# EAGLE design DAPbench-LPC11U35-v1.0.0 (EAGLE 7.7.0)

## Sheet 1 of 4
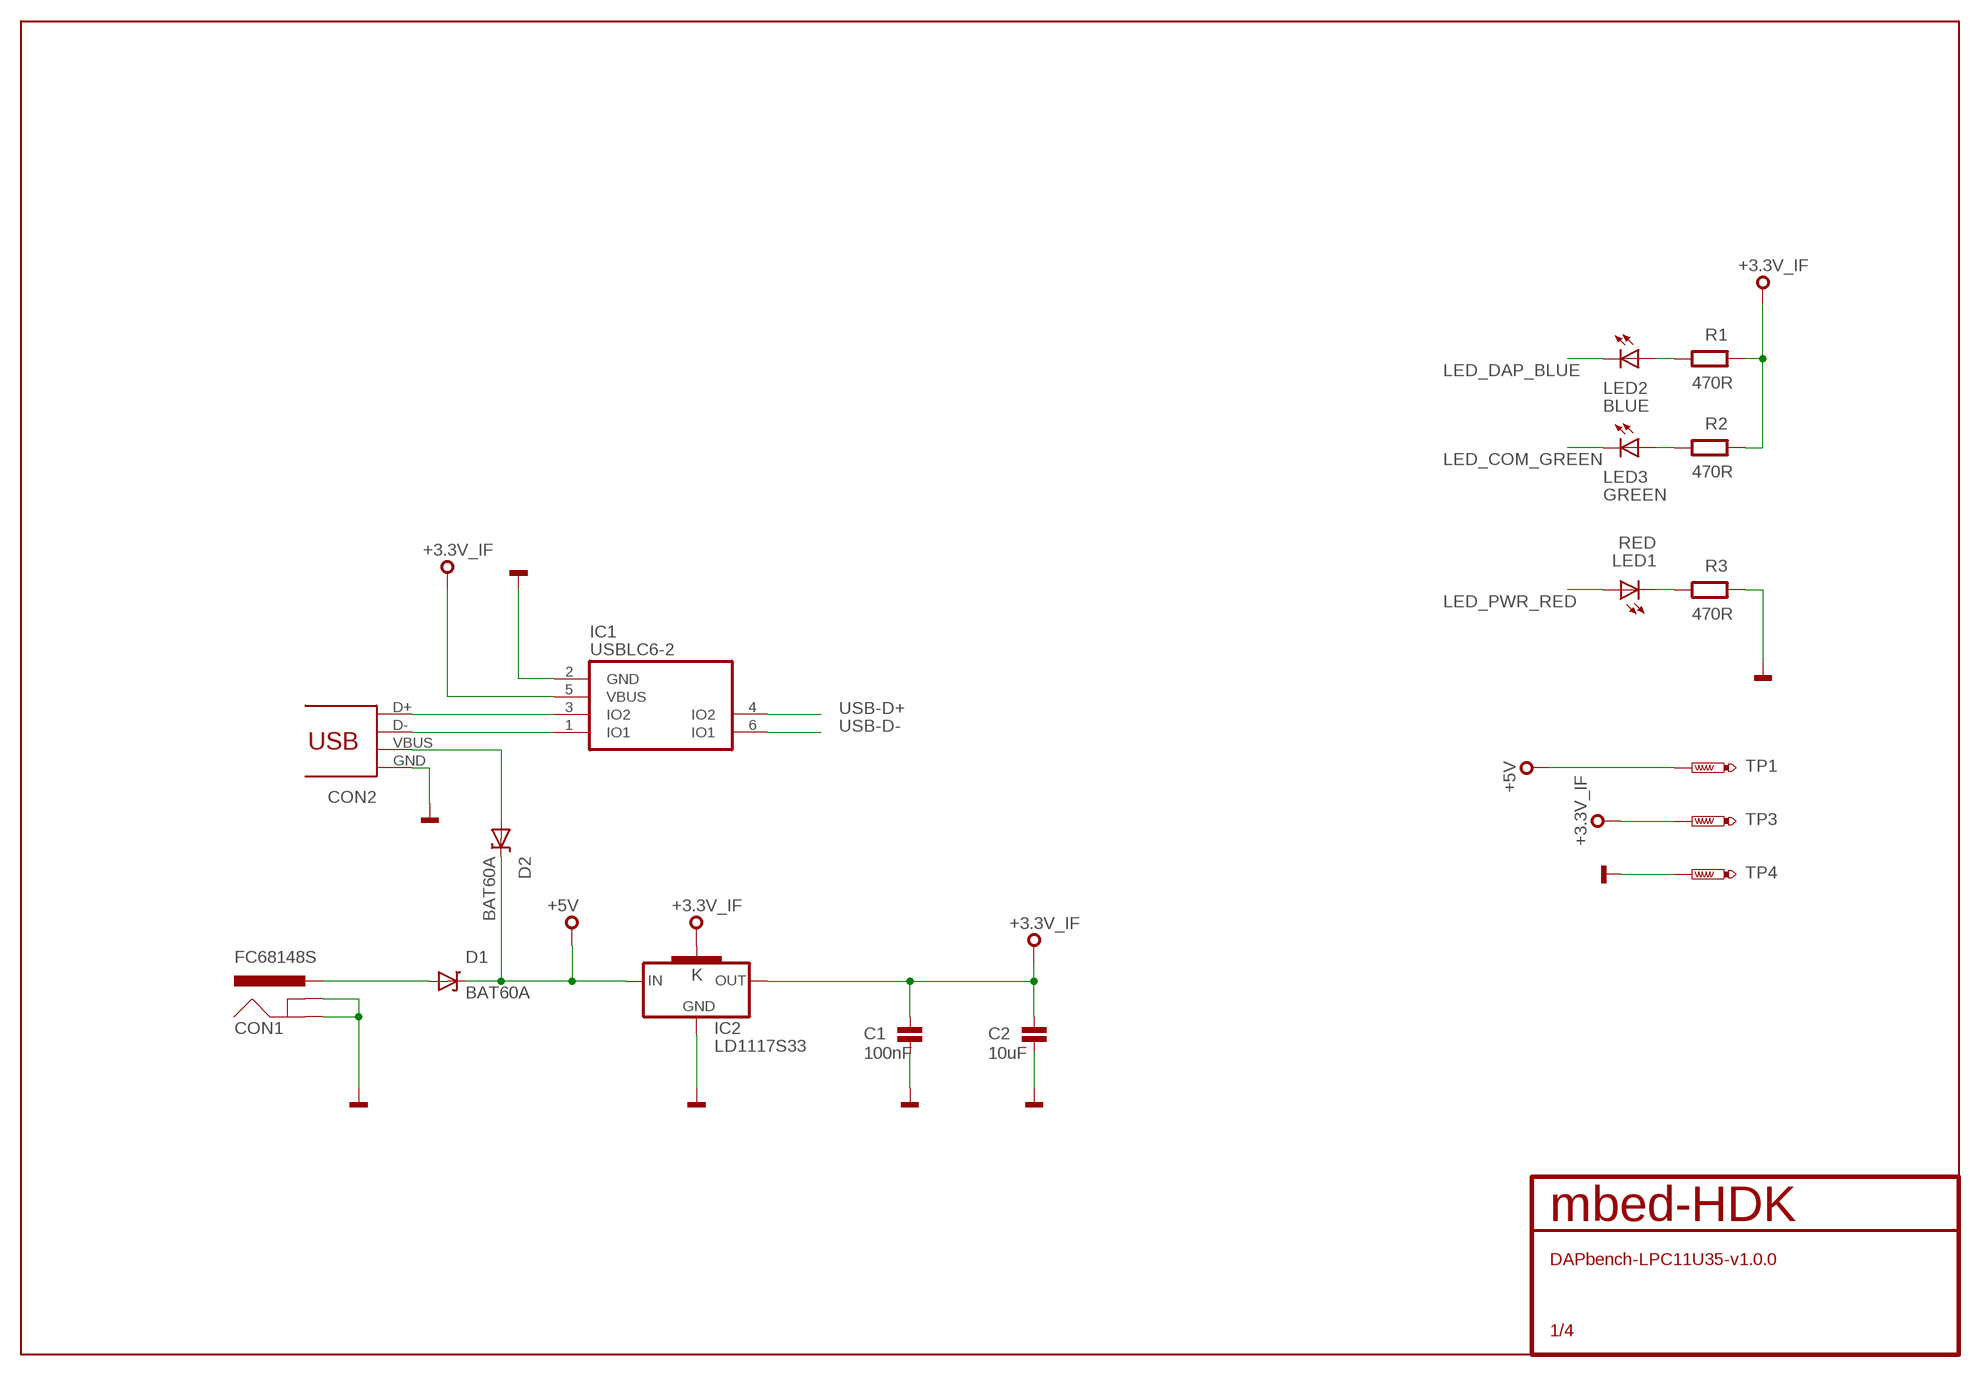
[diagram p0: schematic, sheet 1]

### Parts
C1  100nF  C0603  [0603]
C2  10uF  C0603  [0603]
CON1  FC68148S  [FC68148S]
CON2  USB_MICROB  [MOLEX-47364-0001]
D1  BAT60A  [SOD323]
D2  BAT60A  [SOD323]
IC1  USBLC6-2SC6  [SOT23-6L]
IC2  LD1117S33  [SOT223]
LED1  RED  LED0603  [CHIPLED_0603]
LED2  BLUE  LED0603  [CHIPLED_0603]
LED3  GREEN  LED0603  [CHIPLED_0603]
R1  470R  R0603  [0603@1]
R2  470R  R0603  [0603@1]
R3  470R  R0603  [0603@1]
TP1  TEST-POINT-50R-PTH  [TP50-PTH]
TP3  TEST-POINT-50R-PTH  [TP50-PTH]
TP4  TEST-POINT-50R-PTH  [TP50-PTH]

### Nets
+3.3V_IF: C1.1 C2.1 IC1.5(VBUS) IC2.2(OUT) IC2.4(K) R1.1 R2.1 TP3.TP ; also sheet 2,3,4
+5V: D1.K D2.K IC2.3(IN) TP1.TP ; also sheet 3,4
GND: C1.2 C2.2 CON1.2(GNDBREAK) CON1.3(GND) CON2.GND IC1.2(GND) IC2.1(GND) R3.1 TP4.TP ; also sheet 2,3,4
LED_COM_GREEN: LED3.C ; also sheet 2
LED_DAP_BLUE: LED2.C ; also sheet 2
LED_PWR_RED: LED1.A ; also sheet 2
N$2: LED3.A R2.2
N$3: CON2.D- IC1.1(IO1)
N$4: CON2.D+ IC1.3(IO2)
N$7: LED2.A R1.2
N$8: CON2.VBUS D2.A
N$9: CON1.1-1(PWR) CON1.1-2(PWR) D1.A
N$16: LED1.C R3.2
USB-D+: IC1.4(IO2) ; also sheet 2
USB-D-: IC1.6(IO1) ; also sheet 2

## Sheet 2 of 4
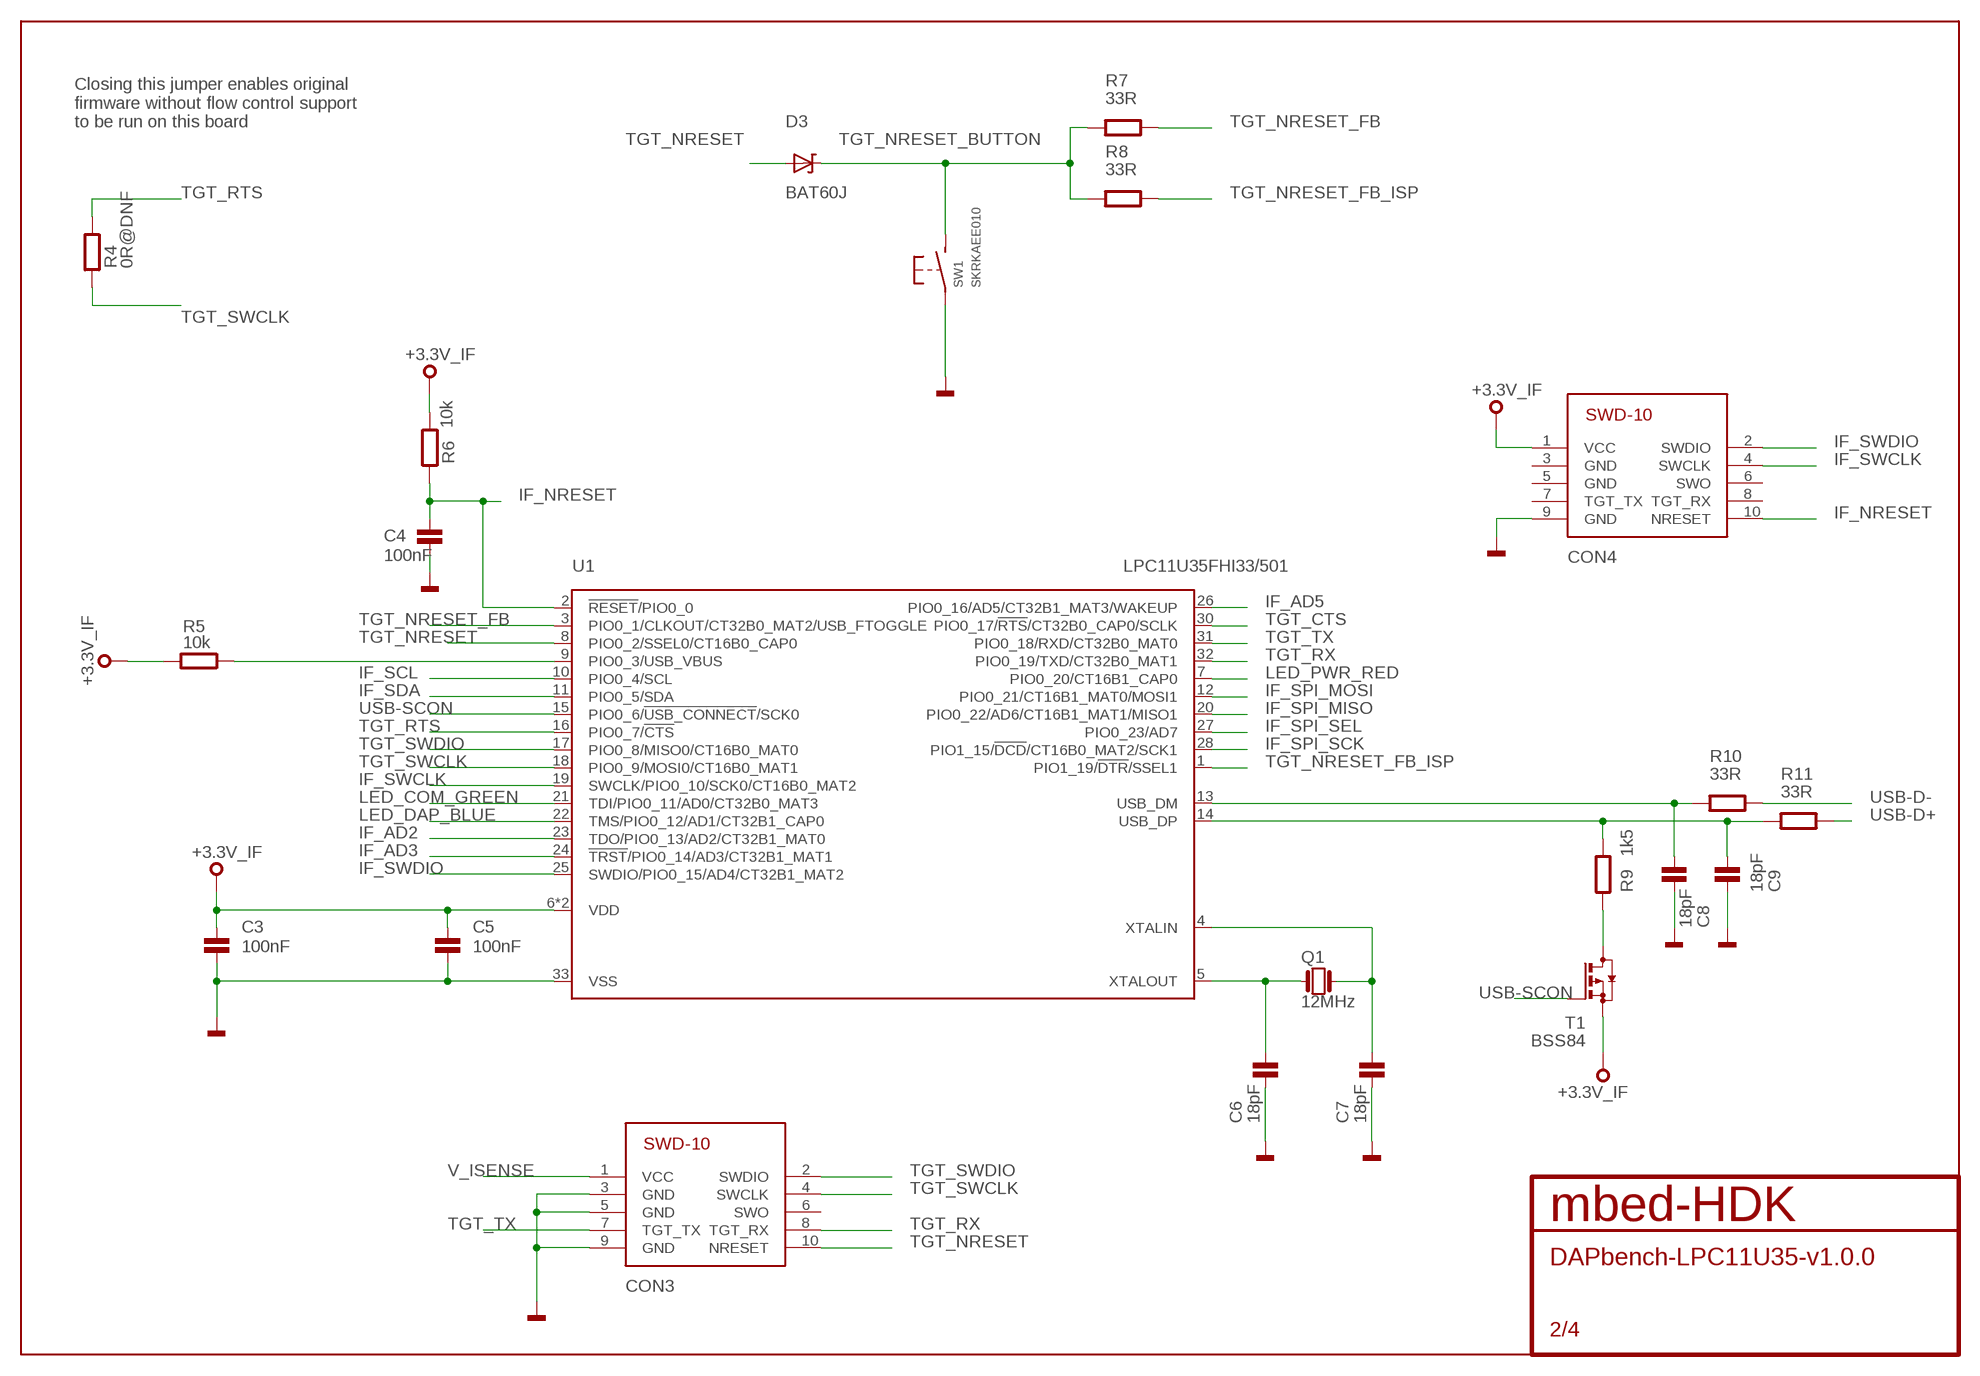
[diagram p1: schematic, sheet 2]

### Parts
C3  100nF  C0603  [0603]
C4  100nF  C0603  [0603]
C5  100nF  C0603  [0603]
C6  18pF  C0603  [0603]
C7  18pF  C0603  [0603]
C8  18pF  C0603  [0603]
C9  18pF  C0603  [0603]
CON3  SWD-10/TC2050_SMD  [FTSH-105-02]
CON4  SWD-10/TC2050_SMD  [FTSH-105-02]
D3  BAT60J  BAT60A  [BAT60A]
Q1  12MHz  Q_3.2X2.5  [3.2X.2.5]
R4  0R@DNF  R0402  [0402@1]
R5  10k  R0603  [0603@1]
R6  10k  R0603  [0603@1]
R7  33R  R0603  [0603@1]
R8  33R  R0603  [0603@1]
R9  1k5  R0603  [0603@1]
R10  33R  R0603  [0603@1]
R11  33R  R0603  [0603@1]
SW1  SKRKAEE010  [SKRKAEE010]
T1  BSS84  [SOT23]
U1  LPC11U35FHI33/501  [SOT617-3]

### Nets
+3.3V_IF: C3.1 C5.1 CON4.1(VCC) R5.2 R6.2 T1.2(S) U1.6(VDD) U1.29(VDD) ; also sheet 1,3,4
GND: C3.2 C4.2 C5.2 C6.2 C7.2 C8.2 C9.2 CON3.3(GND) CON3.5(GND) CON3.9(GND) CON4.9(GND) SW1.P$1(P) U1.33(VSS) ; also sheet 1,3,4
IF_AD2: U1.23(TDO/PIO0_13/AD2/CT32B1_MAT0) ; also sheet 3
IF_AD3: U1.24(!TRST!/PIO0_14/AD3/CT32B1_MAT1) ; also sheet 3
IF_AD5: U1.26(PIO0_16/AD5/CT32B1_MAT3/WAKEUP) ; also sheet 3
IF_NRESET: C4.1 CON4.10(NRESET) R6.1 U1.2(!RESET!/PIO0_0)
IF_SCL: U1.10(PIO0_4/SCL) ; also sheet 3,4
IF_SDA: U1.11(PIO0_5/SDA) ; also sheet 3,4
IF_SPI_MISO: U1.20(PIO0_22/AD6/CT16B1_MAT1/MISO1) ; also sheet 3
IF_SPI_MOSI: U1.12(PIO0_21/CT16B1_MAT0/MOSI1) ; also sheet 3
IF_SPI_SCK: U1.28(PIO1_15/!DCD!/CT16B0_MAT2/SCK1) ; also sheet 3
IF_SPI_SEL: U1.27(PIO0_23/AD7) ; also sheet 3
IF_SWCLK: CON4.4(SWCLK) U1.19(SWCLK/PIO0_10/SCK0/CT16B0_MAT2)
IF_SWDIO: CON4.2(SWDIO) U1.25(SWDIO/PIO0_15/AD4/CT32B1_MAT2)
LED_COM_GREEN: U1.21(TDI/PIO0_11/AD0/CT32B0_MAT3) ; also sheet 1
LED_DAP_BLUE: U1.22(TMS/PIO0_12/AD1/CT32B1_CAP0) ; also sheet 1
LED_PWR_RED: U1.7(PIO0_20/CT16B1_CAP0) ; also sheet 1
N$18: C6.1 Q1.P$1 U1.5(XTALOUT)
N$19: C7.1 Q1.P$3 U1.4(XTALIN)
N$20: R5.1 U1.9(PIO0_3/USB_VBUS)
N$23: R9.1 T1.3(D)
TGT_CTS: U1.30(PIO0_17/!RTS!/CT32B0_CAP0/SCLK) ; also sheet 3
TGT_NRESET: CON3.10(NRESET) D3.A U1.8(PIO0_2/SSEL0/CT16B0_CAP0) ; also sheet 3
TGT_NRESET_BUTTON: D3.K R7.2 R8.2 SW1.P$2(S)
TGT_NRESET_FB: R7.1 U1.3(PIO0_1/CLKOUT/CT32B0_MAT2/USB_FTOGGLE)
TGT_NRESET_FB_ISP: R8.1 U1.1(PIO1_19/!DTR!/SSEL1)
TGT_RTS: R4.2 U1.16(PIO0_7/!CTS!) ; also sheet 3
TGT_RX: CON3.8(TGT_RX) U1.32(PIO0_19/TXD/CT32B0_MAT1) ; also sheet 3
TGT_SWCLK: CON3.4(SWCLK) R4.1 U1.18(PIO0_9/MOSI0/CT16B0_MAT1) ; also sheet 3
TGT_SWDIO: CON3.2(SWDIO) U1.17(PIO0_8/MISO0/CT16B0_MAT0) ; also sheet 3
TGT_TX: CON3.7(TGT_TX) U1.31(PIO0_18/RXD/CT32B0_MAT0) ; also sheet 3
USB-D+: R11.1 ; also sheet 1
USB-D-: R10.1 ; also sheet 1
USB-SCON: T1.1(G) U1.15(PIO0_6/!USB_CONNECT!/SCK0)
USB_DM: C8.1 R10.2 U1.13(USB_DM)
USB_DP: C9.1 R9.2 R11.2 U1.14(USB_DP)
V_ISENSE: CON3.1(VCC) ; also sheet 3
Unconnected: CON3.6(SWO) CON4.3(GND) CON4.5(GND) CON4.6(SWO) CON4.7(TGT_TX) CON4.8(TGT_RX)

### Notes on the sheet
- Closing this jumper enables original
  firmware without flow control support
  to be run on this board

## Sheet 3 of 4
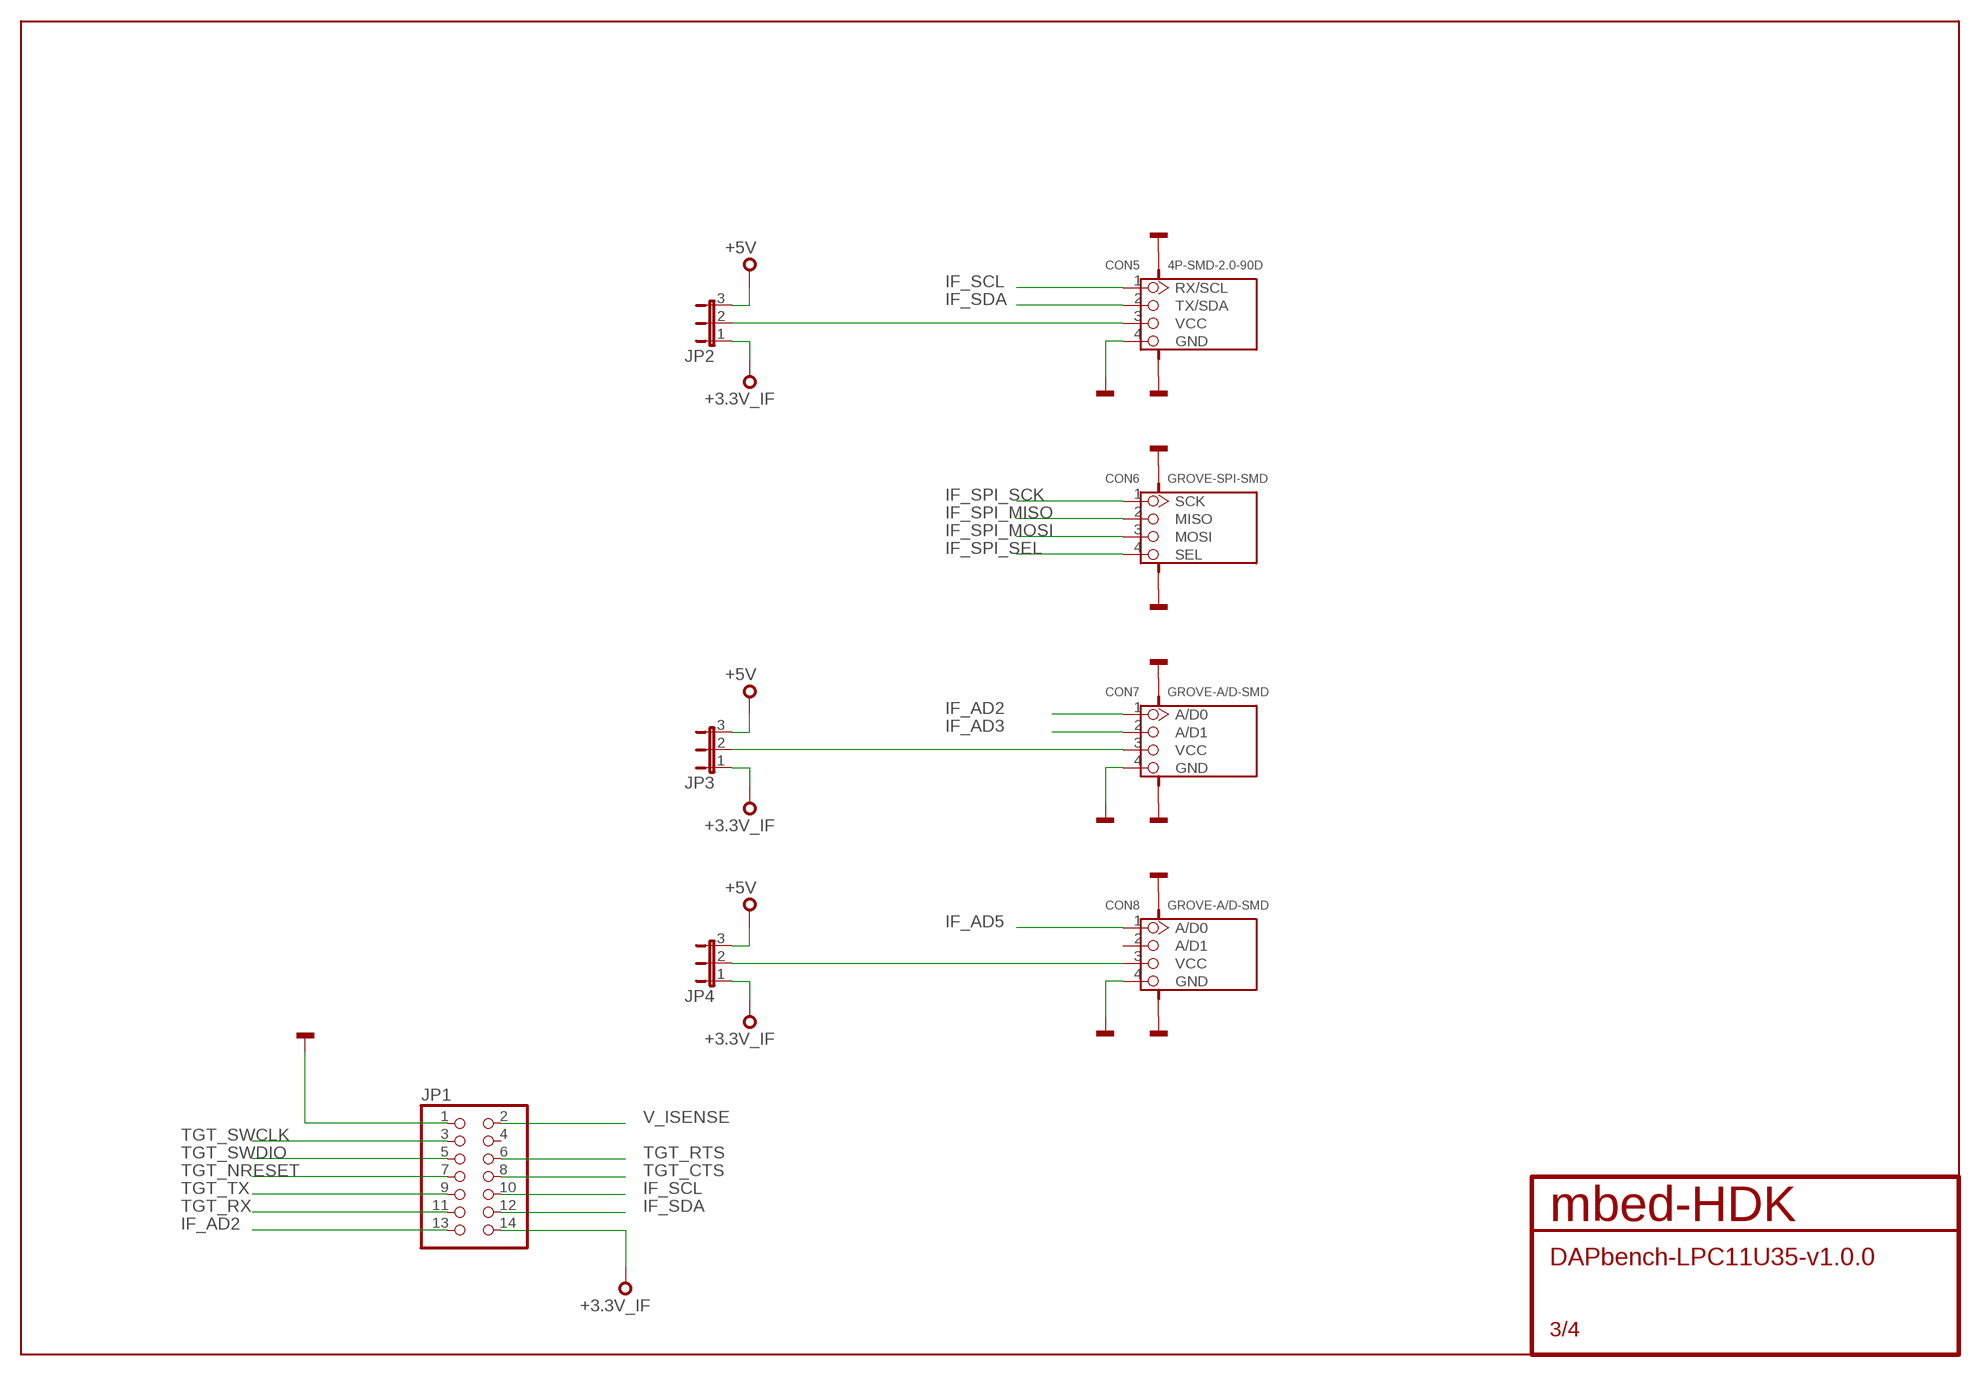
[diagram p2: schematic, sheet 3]

### Parts
CON5  4P-SMD-2.0-90D  GROVE-UART-I2C-SMD  [HW4-SMD-2.0-90D]
CON6  GROVE-SPI-SMD  [HW4-SMD-2.0-90D]
CON7  GROVE-A/D-SMD  [HW4-SMD-2.0-90D]
CON8  GROVE-A/D-SMD  [HW4-SMD-2.0-90D]
JP1  PINHD-2X7  [2X07]
JP2  JP2E  [JP2]
JP3  JP2E  [JP2]
JP4  JP2E  [JP2]

### Nets
+3.3V_IF: JP1.14 JP2.1 JP3.1 JP4.1 ; also sheet 1,2,4
+5V: JP2.3 JP3.3 JP4.3 ; also sheet 1,4
GND: CON5.4(GND) CON5.SS1 CON5.SS2 CON6.SS1 CON6.SS2 CON7.4(GND) CON7.SS1 CON7.SS2 CON8.4(GND) CON8.SS1 CON8.SS2 JP1.1 ; also sheet 1,2,4
IF_AD2: CON7.1(A/D0) JP1.13 ; also sheet 2
IF_AD3: CON7.2(A/D1) ; also sheet 2
IF_AD5: CON8.1(A/D0) ; also sheet 2
IF_SCL: CON5.1(RX/SCL) JP1.10 ; also sheet 2,4
IF_SDA: CON5.2(TX/SDA) JP1.12 ; also sheet 2,4
IF_SPI_MISO: CON6.2(MISO) ; also sheet 2
IF_SPI_MOSI: CON6.3(MOSI) ; also sheet 2
IF_SPI_SCK: CON6.1(SCK) ; also sheet 2
IF_SPI_SEL: CON6.4(SEL) ; also sheet 2
N$1: CON5.3(VCC) JP2.2
N$5: CON7.3(VCC) JP3.2
N$6: CON8.3(VCC) JP4.2
TGT_CTS: JP1.8 ; also sheet 2
TGT_NRESET: JP1.7 ; also sheet 2
TGT_RTS: JP1.6 ; also sheet 2
TGT_RX: JP1.11 ; also sheet 2
TGT_SWCLK: JP1.3 ; also sheet 2
TGT_SWDIO: JP1.5 ; also sheet 2
TGT_TX: JP1.9 ; also sheet 2
V_ISENSE: JP1.2 ; also sheet 2
Unconnected: CON8.2(A/D1) JP1.4

## Sheet 4 of 4
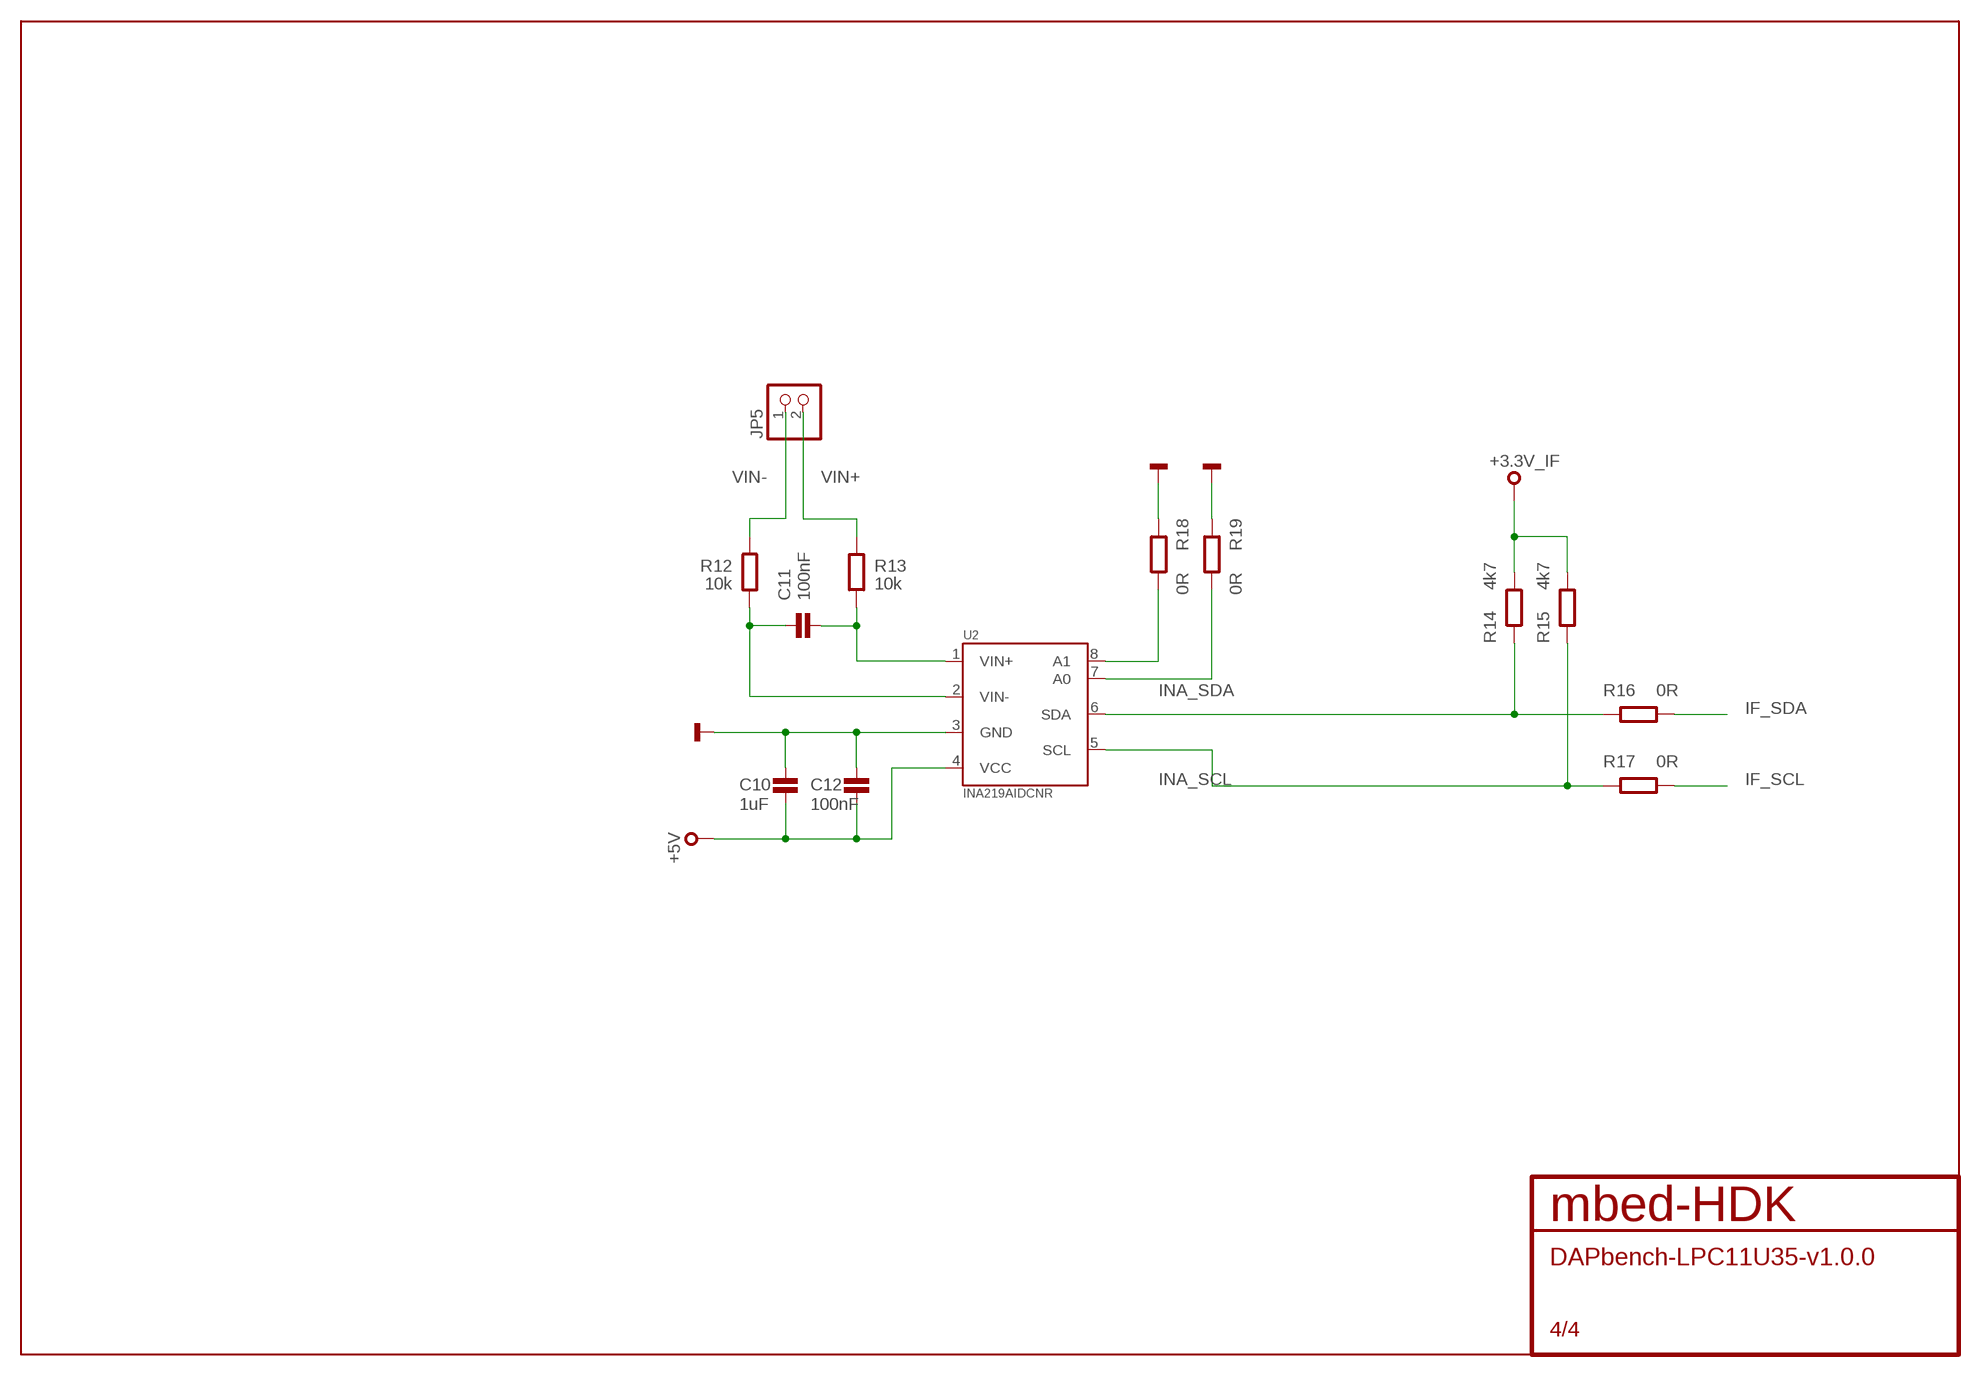
[diagram p3: schematic, sheet 4]

### Parts
C10  1uF  C0603  [0603]
C11  100nF  C0603  [0603]
C12  100nF  C0603  [0603]
JP5  PINHD-1X2  [1X02]
R12  10k  R0603  [0603@1]
R13  10k  R0603  [0603@1]
R14  4k7  R0603  [0603@1]
R15  4k7  R0603  [0603@1]
R16  0R  R0603  [0603@1]
R17  0R  R0603  [0603@1]
R18  0R  R0603  [0603@1]
R19  0R  R0603  [0603@1]
U2  INA219AIDCNR  [SOT23-8]

### Nets
+3.3V_IF: R14.1 R15.1 ; also sheet 1,2,3
+5V: C10.2 C12.2 U2.4(VCC) ; also sheet 1,3
GND: C10.1 C12.1 R18.2 R19.2 U2.3(GND) ; also sheet 1,2,3
IF_SCL: R17.1 ; also sheet 2,3
IF_SDA: R16.1 ; also sheet 2,3
INA_SCL: R15.2 R17.2 U2.5(SCL)
INA_SDA: R14.2 R16.2 U2.6(SDA)
N$13: R18.1 U2.8(A1)
N$14: R19.1 U2.7(A0)
N$15: C11.2 R12.1 U2.2(VIN-)
N$17: C11.1 R13.1 U2.1(VIN+)
VIN+: JP5.2 R13.2
VIN-: JP5.1 R12.2

## Library data of the parts
C1-C12 = mbed-HDK:C: Capacitor
CON1 = mbed-HDK-Connector:FC68148S: Power Jack This is the standard 5.5mm barrel jack for power. The PTH is the most common, proven, reliable, footprint. The Slot footprint only works if the mill layer is transmitted to the PCB fab house so be warned. Mating wall wart : TOL-00298 (and others); MF: Cliff; MFN: FC68148S; OC_NEWARK: 1889309
CON2 = mbed-HDK:USB: USB Connectors
CON3 CON4 = mbed-HDK-Connector:SWD-10/TC2050: 1mm pitch 10-Pin Cortex Programming Header with optional TC2050 footprint solderless interchangeable
CON5 = mbed-HDK-Connector:GROVE-UART-I2C-SMD: 320110032
CON6 = mbed-HDK-Connector:GROVE-SPI-SMD
CON7 CON8 = mbed-HDK-Connector:GROVE-A/D-SMD
D1 D2 = mbed-HDK-Transistor:BAT60A: SCHOTTKY DIODE; MF: Infineon; MFN: BAT60AE6327HTSA1; OC-DIGIKEY: BAT60AE6327HTSA1CT-ND; OC-MOUSER: 726-BAT60AE6327; OC-NEWARK: 85X4127
D3 = mbed-HDK:BAT60A: Schottky Diode
IC1 = mbed-HDK:USBLC6-2
IC2 = mbed-HDK:LD1117S33: VOLTAGE REGULATOR SMD 3,3V
JP1 = pinhead:PINHD-2X7: PIN HEADER
JP2-JP4 = jumper:JP2E: JUMPER
JP5 = pinhead:PINHD-1X2: PIN HEADER
LED1-LED3 = mbed-HDK:LED: SMD LED
Q1 = mbed-HDK:Q
R1-R19 = mbed-HDK:R
SW1 = mbed-HDK-Switch:SKRKAEE010: MOMENTARY SWITCH PUSH VERTICAL (SPST); MF: ALPS; MFN: SKRKAEE010; OC-MOUSER: 688-SKRKAE
T1 = mbed-HDK:BSS84: P-CHANNEL MOS FET
TP1 TP3 TP4 = mbed-HDK:TEST-POINT
U1 = mbed-HDK-MF-NXP:LPC11U35FHI33: 32 Bit Microcontroller, ARM Cortex-M0, 50 MHz, 64 KB, 12 KB, 33 Pins, HVQFN; MF: NXP; MFN: LPC11U35FHI33/501; OC-DIGIKEY: 568-9586-ND; OC-MOUSER: 771-LPC11U35FHI33501; OC-NEWARK: 2115658
U2 = mbed-HDK-IC:INA219AIDCNR: Current Sense - I2C Bi-Directional CURRENT/POWER MONITOR with I2C Interface; MF: Texas Instruments; MFN: INA219AIDCNR; OC-DIGIKEY: 296-23770-1-ND; OC-MOUSER: 595-INA219AIDCNR; OC-NEWARK: 2295989

## Board
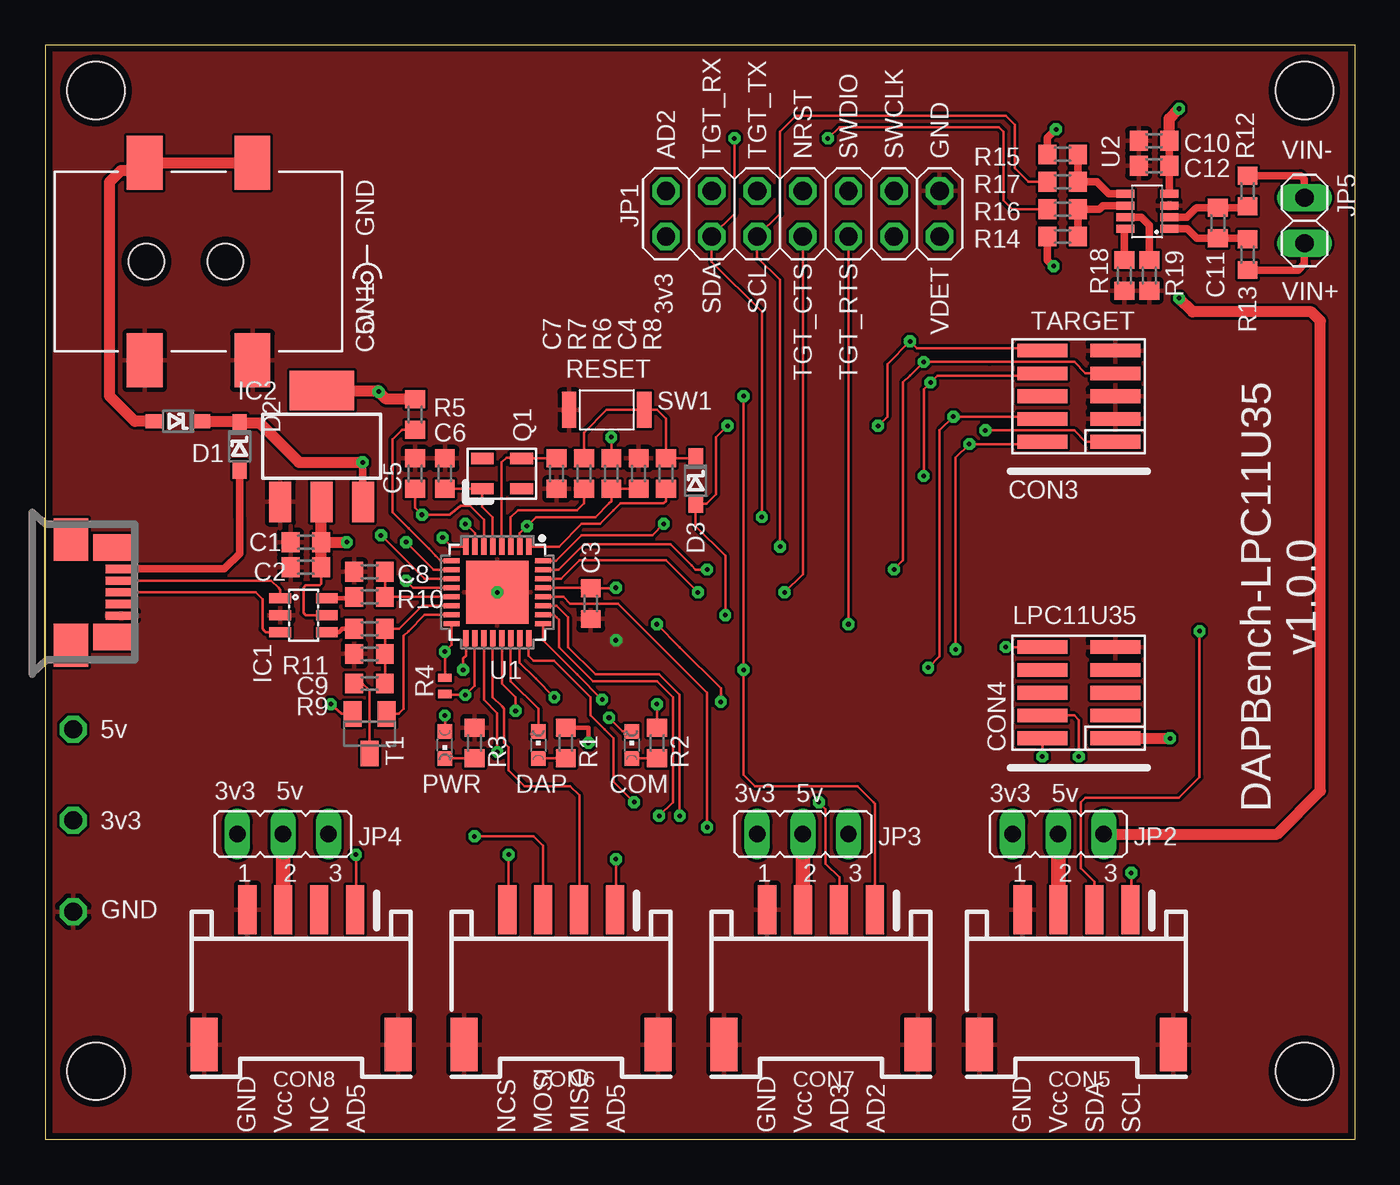
[diagram p4: board, top side]
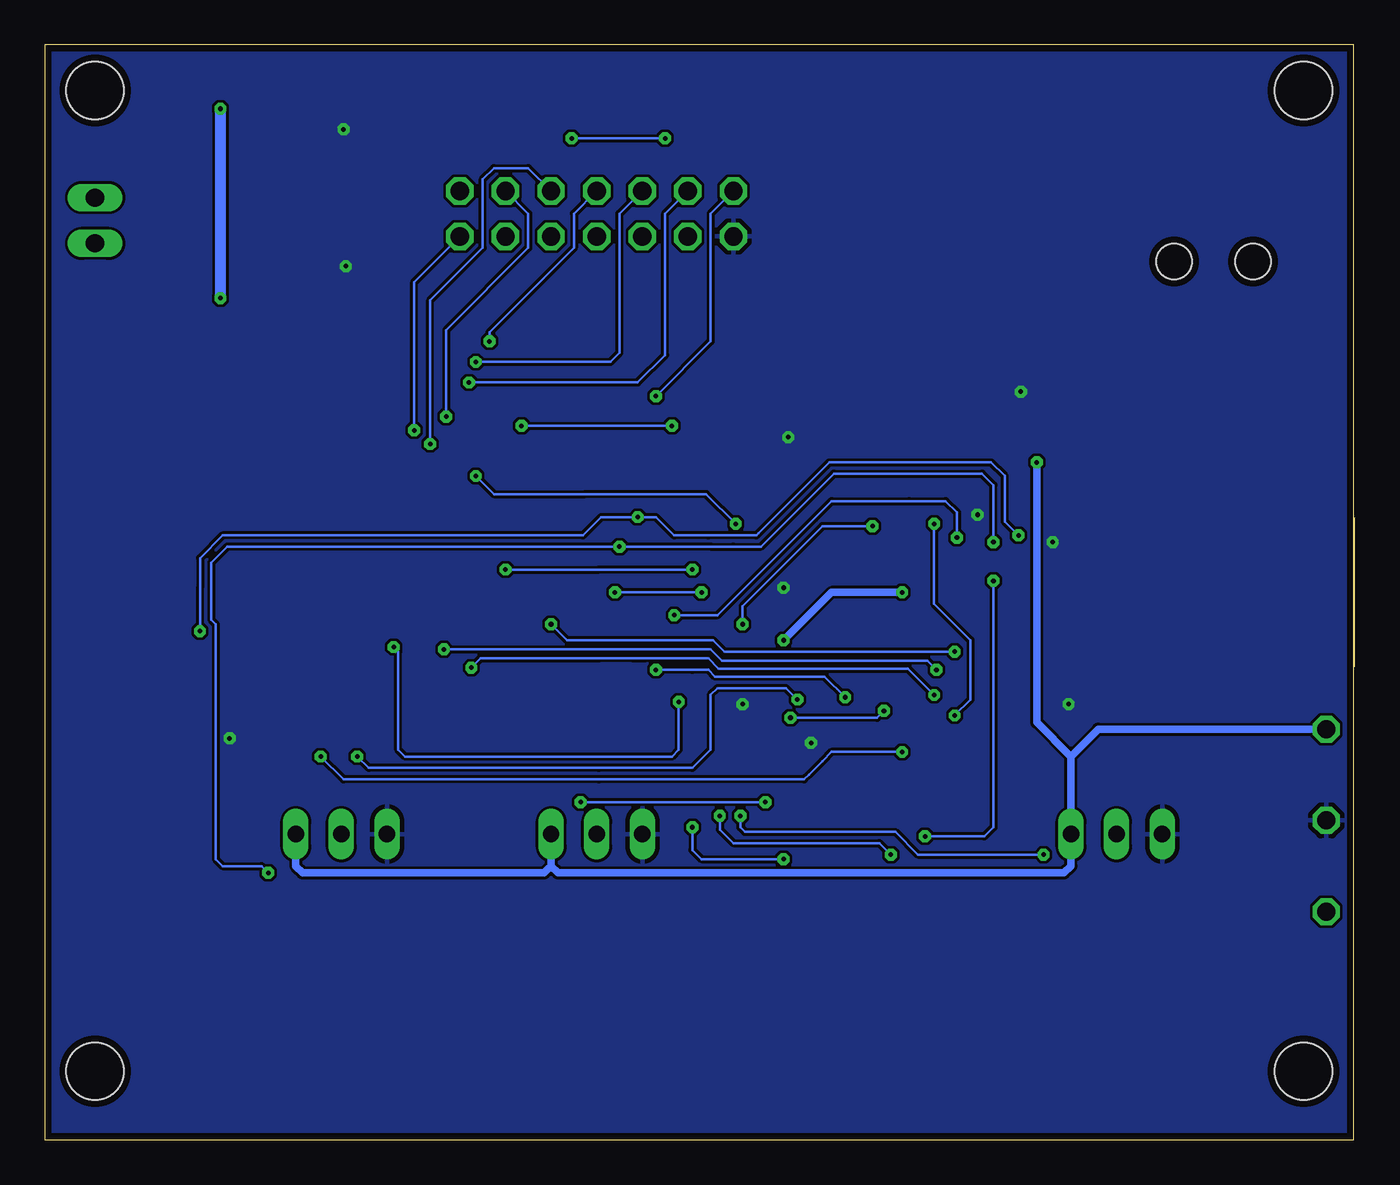
[diagram p5: board, bottom side, seen from below]

Size 72.95 x 60.96 mm. Coordinates in mm from the lower left corner, seen from the top.
Outline: 0.05,60.96 72.95,60.96 72.95,0 0.05,0 0.05,60.96
Copper layers ((1*16)): Top 0.035mm / dielectric 0.8mm / Bottom 0.035mm
Design rules "mbed-HDK-6-6-2-layer": minimum track width 6mil, minimum drill 9mil, track to track 6mil, track to pad 6mil, pad to pad 6mil, via to via 6mil, smd to smd 6mil, copper to edge 15mil, drill to drill 8mil, minimum pad ring 10mil, minimum via ring 8mil, stop-mask expansion 4mil, vias tented up to drill 0mil, thermal gap 10mil
Holes 3.2 mm at 2.85,58.42 70.16,58.42 2.85,3.81 70.16,3.81

### Footprints (pad centres in the part's own frame; a part is rotated, then mirrored left to right if it is on the bottom)
0603 = smd 1 x 1.1: 1 -0.85,0; 2 0.85,0
FC68148S = smd 3 x 2: 1-1 5.5,-5; 1-2 5.5,-11; 2 -5.5,-11; 3 -5.5,-5 | hole 2: 0,-5.1; 0,-9.5
MOLEX-47364-0001 = smd 1.7 x 0.45: 4 2.8,-0.65; D+ 2.8,0; D- 2.8,0.65; GND 2.8,-1.3; VBUS 2.8,1.3 | smd 1.9 x 2.375: GND1 0,2.95; GND4 0,-2.95 | smd 2.1 x 1.475: GND2 2.3,2.5; GND3 2.3,-2.5
FTSH-105-02 = smd 0.762 x 2.794: 1 0.381,-2.032; 2 0.381,2.032; 3 1.651,-2.032; 4 1.651,2.032; 5 2.921,-2.032; 6 2.921,2.032; 7 4.191,-2.032; 8 4.191,2.032; 9 5.461,-2.032; 10 5.461,2.032
HW4-SMD-2.0-90D = smd 1.01 x 2.74: 1 -3,-0.1; 2 -1,-0.1; 3 1,-0.1; 4 3,-0.1 | smd 1.5 x 3: SS1 -5.4,7.4; SS2 5.4,7.4
SOD323 = smd 1 x 0.8: A 1.3,0; K -1.3,0
BAT60A = smd 1 x 0.8: A 1.3,0; K -1.3,0
SOT23-6L = smd 0.55 x 1.2: 1 -0.95,-1.3; 2 0,-1.3; 3 0.95,-1.3; 4 0.95,1.3; 5 0,1.3; 6 -0.95,1.3
SOT223 = smd 1.219 x 2.235: 1 -2.311,-3.099; 2 0,-3.099; 3 2.311,-3.099 | smd 3.6 x 2.2: 4 0,3.099
2X07 = drill 1.016 octagon: 1 -7.62,-1.27; 2 -7.62,1.27; 3 -5.08,-1.27; 4 -5.08,1.27; 5 -2.54,-1.27; 6 -2.54,1.27; 7 0,-1.27; 8 0,1.27; 9 2.54,-1.27; 10 2.54,1.27; 11 5.08,-1.27; 12 5.08,1.27; 13 7.62,-1.27; 14 7.62,1.27
JP2 = drill 0.914 long: 1 -2.54,0; 2 0,0; 3 2.54,0
1X02 = drill 1.016 long: 1 -1.27,0; 2 1.27,0
CHIPLED_0603 = smd 0.8 x 0.8: A 0,-0.75; C 0,0.75
3.2X.2.5 = smd 1.27 x 0.635: P$1 -1.092,-0.838; P$2 1.092,-0.838; P$3 1.092,0.838; P$4 -1.092,0.838
0603@1 = smd 1 x 1.1: 1 -0.85,0; 2 0.85,0
0402@1 = smd 0.457 x 0.762: 1 -0.457,0; 2 0.457,0
SKRKAEE010 = smd 0.8 x 2: P$1 -2.1,0; P$2 2.1,0
SOT23 = smd 1 x 1.4: 1 -0.95,-1.1; 2 0.95,-1.1; 3 0,1.1
TP50-PTH = drill 1 octagon: TP 0,0
SOT617-3 = smd 0.9 x 0.29: 1 -2.55,1.75; 2 -2.55,1.25; 3 -2.55,0.75; 4 -2.55,0.25; 5 -2.55,-0.25; 6 -2.55,-0.75; 7 -2.55,-1.25; 8 -2.55,-1.75; 17 2.55,-1.75; 18 2.55,-1.25; 19 2.55,-0.75; 20 2.55,-0.25; 21 2.55,0.25; 22 2.55,0.75; 23 2.55,1.25; 24 2.55,1.75 | smd 0.29 x 0.9: 9 -1.75,-2.55; 10 -1.25,-2.55; 11 -0.75,-2.55; 12 -0.25,-2.55; 13 0.25,-2.55; 14 0.75,-2.55; 15 1.25,-2.55; 16 1.75,-2.55; 25 1.75,2.55; 26 1.25,2.55; 27 0.75,2.55; 28 0.25,2.55; 29 -0.25,2.55; 30 -0.75,2.55; 31 -1.25,2.55; 32 -1.75,2.55 | smd 3.5 x 3.5: 33 0,0
SOT23-8 = smd 1 x 0.45: 1 -1.225,0.975; 2 -1.225,0.325; 3 -1.225,-0.325; 4 -1.225,-0.975; 5 1.225,-0.975; 6 1.225,-0.325; 7 1.225,0.325; 8 1.225,0.975

### Placement (x,y rotation side)
C1  14.53,33.27 180 top
C2  14.53,31.88 180 top
C3  30.41,29.84 270 top
C4  33.07,37.08 90 top
C5  20.63,37.08 90 top
C6  22.28,37.08 90 top
C7  28.5,37.08 270 top
C8  18.09,31.62 180 top
C9  18.09,27.05 180 top
C10  61.78,55.63 0 top
C11  65.33,51.05 90 top
C12  61.78,54.23 0 top
CON1  0.56,48.89 90 top
CON2  1.45,30.48 0 top
CON3  57.58,38.48 90 top
CON4  57.58,21.97 90 top
CON5  57.46,12.7 180 top
CON6  28.75,12.7 180 top
CON7  43.23,12.7 180 top
CON8  14.28,12.7 180 top
D1  7.42,40.01 180 top
D2  10.85,38.61 270 top
D3  36.25,36.7 270 top
IC1  14.4,29.21 270 top
IC2  15.42,38.61 0 top
JP1  42.22,51.56 180 top
JP2  56.44,17.02 0 top
JP3  42.22,17.02 0 top
JP4  13.26,17.02 0 top
JP5  70.16,51.18 270 top
LED1  22.28,21.97 180 top
LED2  27.48,21.97 0 top
LED3  32.69,21.97 0 top
Q1  25.45,37.08 0 top
R1  29.01,22.1 270 top
R2  34.09,22.1 270 top
R3  23.93,22.1 270 top
R4  22.28,25.27 90 top
R5  20.63,40.39 90 top
R6  31.55,37.08 90 top
R7  30.02,37.08 90 top
R8  34.6,37.08 90 top
R9  18.09,25.4 0 top
R10  18.09,30.23 0 top
R11  18.09,28.45 0 top
R12  66.98,52.83 90 top
R13  66.98,49.28 270 top
R14  56.69,50.29 0 top
R15  56.69,54.86 0 top
R16  56.69,51.82 0 top
R17  56.69,53.34 0 top
R18  60.12,48.13 270 top
R19  61.52,48.13 270 top
SW1  31.3,40.64 0 top
T1  18.09,22.61 180 top
TP1  1.58,22.86 0 top
TP3  1.58,17.78 90 top
TP4  1.58,12.7 90 top
U1  25.2,30.48 270 top
U2  61.39,51.69 180 top

### Tracks (layer width: path | path; a pad name or v marks a point on that pad's centre or on a via)
+3.3V_IF  (via drill 0.25, 0.25 pad 0.25)
  Top 0.152: U1.29 30.37,30.73 C3.1 31.76,30.7 v31.8,30.73 | R6.2 31.55,38.61 v31.55,39.12 | U1.6 24.45,34.53 23.68,35.31 23.17,35.31 22.53,34.8 v21.01,34.8 20.63,35.18 C5.1 | R2.1 v34.09,24.26 | T1.2 16.52,23.71 v15.93,24.26 | C2.1 15.38,30.95 15.29,30.86 14.53,30.86 14.4,30.73 14.4,29.34 14.53,29.21 IC1.5
  Top 0.254: R1.1 30.28,22.95 v30.28,22.1
  Top 0.406: R14.1 55.84,48.98 v56.19,48.64 | R15.1 55.84,55.79 v56.31,56.26
  Top 0.61: IC2.4 18.54,41.71 v18.59,41.66 19.02,41.24 R5.2 | C2.1 C1.1 | C1.1 v16.82,33.27 | C1.1 15.38,35.47 IC2.2 | CON4.1 v62.66,22.35
  pour Bottom: 0.05,0 72.95,0 72.95,60.96 0.05,60.96
+5V  (via drill 0.25)
  Top 0.406: v17.71,37.72 17.71,35.53 IC2.3 | U2.4 C12.2 C10.2
  Top 0.61: 10.78,39.98 D2.K | D2.K 11.96,39.91 14.15,37.72 v17.71,37.72 | D1.K 10.85,40.01 D2.K | C10.2 62.62,56.86 v63.17,57.4 | JP2.3 68.63,17.02 71.05,19.43 71.05,45.59 70.54,46.1 63.93,46.1 v63.17,46.86
  Bottom 0.406: 15.8,21.34 JP4.3 15.8,15.24 16.18,14.86 44.38,14.86 44.76,15.24 | 15.8,21.34 17.71,23.24 v17.71,37.72 | JP2.3 58.98,15.24 58.6,14.86 45.14,14.86 44.88,15.11 | 44.88,15.11 44.76,15.24 | JP3.3 44.76,15.24 | 44.76,15.24 44.88,15.11 | 15.8,21.34 14.28,22.86 TP1.TP
  Bottom 0.61: v63.17,46.86 v63.17,57.4
GND  (via drill 0.25 pad 0.25)
  Bottom 0.406: U1.33 29.14,30.48 v31.8,27.81
  other vias: 25.2,30.48
  pour Top: 0.05,0 72.95,0 72.95,60.96 0.05,60.96
IF_AD2  (via drill 0.25)
  Top 0.152: U1.23 26.45,26.56 27.36,25.65 v28.37,24.64 | v38.92,41.4 v38.92,26.16 38.92,20.32 39.55,19.69 45.27,19.69 46.15,18.8 46.23,18.72 CON7.1
  Bottom 0.152: v28.37,24.64 29.52,25.78 35.61,25.78 35.99,26.16 36.88,26.16 v38.92,26.16 | JP1.13 35.87,51.56 35.87,44.45 v38.92,41.4
IF_AD3  (via drill 0.25)
  Top 0.152: U1.24 26.95,26.95 27.23,26.67 27.61,26.67 28.37,26.67 30.41,24.64 30.41,23.62 31.17,22.86 31.68,22.35 31.68,19.94 v32.82,18.8 | v43.11,18.8 43.49,18.41 43.49,15.37 44.25,14.61 44.25,12.82 CON7.2
  Bottom 0.152: v32.82,18.8 v43.11,18.8
IF_AD5  (via drill 0.25)
  Top 0.152: U1.26 28.35,29.23 28.5,29.08 28.63,28.96 28.63,27.43 30.53,25.53 34.09,25.53 34.98,24.64 34.98,18.8 v34.22,18.03 | v17.32,15.88 17.32,12.85 CON8.1
  Bottom 0.152: v34.22,18.03 34.22,17.4 33.96,17.14 25.58,17.14 24.31,15.88 v17.32,15.88
IF_NRESET  (via drill 0.25)
  Top 0.152: C4.1 R6.1 31.55,35.56 31.42,35.43 30.66,34.67 27.99,34.67 27.36,34.67 v26.85,34.16 26.45,33.76 U1.2 | v34.09,28.7 35.36,27.43 37.64,25.15 v37.64,24.38 | v53.52,27.43 CON4.10
  Bottom 0.152: v26.85,34.16 29.64,34.16 34.09,29.72 v34.09,28.7 | v37.64,24.38 37.64,21.72 38.03,21.34 42.09,21.34 52.89,21.34 53.27,21.72 53.27,27.18 v53.52,27.43
IF_SCL  (via drill 0.25)
  Top 0.152: U1.10 21.66,31.73 v20.12,33.27 | v60.5,14.86 60.5,12.85 CON5.1 | v40.95,33.02 40.95,47.88 39.68,49.15 JP1.10 40.95,51.56 40.95,56.13 41.84,57.02 53.52,57.02 54.03,56.52 54.03,54.1 54.79,53.34 R17.1
  Bottom 0.152: v20.12,33.27 20.12,36.45 20.75,37.08 29.01,37.08 33.07,33.02 34.6,33.02 35.87,33.02 v40.95,33.02 62.79,33.02 63.68,32.13 63.68,30.73 63.68,28.96 63.43,28.7 63.43,15.62 63.05,15.24 60.89,15.24 v60.5,14.86
IF_SDA  (via drill 0.25)
  Top 0.152: U1.11 21.15,31.23 v18.72,33.66 | CON5.2 58.46,14.37 57.71,15.11 57.71,18.8 57.97,19.05 63.17,19.05 64.31,20.19 v64.31,28.32 | v39.93,34.67 39.93,46.1 37.14,48.89 JP1.12 38.41,51.56 v38.41,55.75 | R16.1 53.9,51.82 53.39,52.32 53.39,56.13 53.14,56.39 44.25,56.39 v43.61,55.75
  Bottom 0.152: v18.72,33.66 19.48,34.42 19.48,36.96 20.25,37.72 29.26,37.72 33.2,33.78 33.33,33.66 35.99,33.66 37.9,33.66 38.92,34.67 v39.93,34.67 41.96,34.67 42.98,33.66 63.05,33.66 64.31,32.38 64.31,30.73 v64.31,28.32 | v43.61,55.75 v38.41,55.75
IF_SPI_MISO
  Top 0.152: U1.20 24.95,25.02 24.95,24.63 25.45,24.13 25.58,24 25.58,22.1 25.83,21.84 25.83,20.57 26.72,19.69 29.26,19.69 29.77,19.18 29.77,12.82 CON6.2
IF_SPI_MOSI  (via drill 0.25)
  Top 0.152: U1.12 20.5,30.73 v20.12,31.12 | v23.93,16.89 27.23,16.89 27.74,16.38 27.74,12.82 CON6.3
  Bottom 0.152: v20.12,31.12 20.12,17.4 20.63,16.89 v23.93,16.89
IF_SPI_SCK  (via drill 0.25)
  Top 0.152: U1.28 28.88,30.23 29.26,29.84 31.68,29.84 31.93,29.84 36.88,24.89 v36.88,17.4 | v31.8,15.62 31.8,12.85 CON6.1
  Bottom 0.152: v36.88,17.4 36.88,16.13 36.38,15.62 v31.8,15.62
IF_SPI_SEL  (via drill 0.25)
  Top 0.152: U1.27 28.49,29.73 29.14,29.08 29.14,27.43 30.66,25.91 34.22,25.91 35.36,24.77 v35.36,18.03 | v25.83,15.88 25.83,12.88 CON6.4
  Bottom 0.152: v35.36,18.03 35.36,17.27 34.6,16.51 26.47,16.51 v25.83,15.88
IF_SWCLK  (via drill 0.25)
  Top 0.152: v25.2,21.59 25.2,22.35 25.2,23.75 24.45,24.5 U1.19 | v57.58,21.34 57.58,23.37 57.33,23.62 CON4.4
  Bottom 0.152: v25.2,21.59 29.14,21.59 29.64,21.08 30.41,20.32 30.66,20.07 42.09,20.07 56.31,20.07 v57.58,21.34
IF_SWDIO  (via drill 0.25)
  Top 0.152: U1.25 27.75,27.8 29.64,25.91 v31.04,24.51 | v55.55,21.34 CON4.2
  Bottom 0.152: v31.04,24.51 31.68,25.15 35.49,25.15 35.87,24.77 35.87,21.72 36.88,20.7 42.09,20.7 54.92,20.7 v55.55,21.34
INA_SCL
  Top 0.406: U2.5 59.28,52.66 58.6,53.34 R17.2 R15.2
INA_SDA
  Top 0.406: R14.2 R16.2 58.73,51.82 58.92,52.01 U2.6
LED_COM_GREEN  (via drill 0.25 pad 0.25)
  Top 0.152: U1.21 25.45,27.05 25.45,26.92 25.45,25.53 25.45,25.4 26.21,24.64 v26.21,23.88 | v31.42,23.5 32.18,22.73 32.68,22.73 LED3.C
  Bottom 0.152: v26.21,23.88 26.6,23.5 v31.42,23.5
LED_DAP_BLUE
  Top 0.152: U1.22 25.95,25.92 25.95,25.54 27.48,24 LED2.C
LED_PWR_RED  (via drill 0.25 pad 0.25)
  Top 0.152: U1.7 23.95,33.76 v23.42,34.29 | LED1.A v22.28,23.62
  Bottom 0.152: v23.42,34.29 23.42,29.84 21.39,27.81 21.39,24.51 v22.28,23.62
N$1
  Top 0.813: CON5.3 56.44,12.82 JP2.2
N$2
  Top 0.152: R2.2 32.72,21.25 LED3.A
N$3
  Top 0.152: CON2.D- 12.61,31.13 13.01,30.73 13.1,30.64 IC1.1
N$4
  Top 0.152: CON2.D+ 11.74,30.48 12.12,30.1 12.12,28.45 12.25,28.32 12.31,28.26 IC1.3
N$5
  Top 0.813: CON7.3 42.22,12.82 JP3.2
N$6
  Top 0.813: CON8.3 13.26,12.82 JP4.2
N$7
  Top 0.152: R1.2 27.51,21.25 LED2.A
N$8
  Top 0.406: CON2.VBUS 9.99,31.78 10.85,32.64 10.85,34.67 D2.A
N$9
  Top 0.61: D1.A 5.01,40.01 4.5,40.51 3.61,41.4 3.61,53.34 4.24,53.98 6.16,53.98 CON1.1-1 CON1.1-2
N$13
  Top 0.406: U2.8 60.12,50.67 R18.1
N$14
  Top 0.406: U2.7 61.08,51.36 61.52,50.93 R19.1
N$15
  Top 0.406: R12.1 66.9,51.9 C11.2 64.15,51.9 64.06,51.82 63.61,51.36 U2.2
N$16
  Top 0.152: 22.3,21.25 R3.2
  Top 0.406: LED1.C 22.3,21.25
N$17
  Top 0.406: R13.1 66.9,50.2 C11.1 64.15,50.2 64.06,50.29 63.64,50.71 U2.1
N$18
  Top 0.152: U1.5 24.95,34.67 24.36,35.26 Q1.P$1 22.29,36.25 C6.1
N$19
  Top 0.152: C7.1 26.56,37.93 Q1.P$3 26.49,37.97 25.71,37.97 25.45,37.72 U1.4
N$20
  Top 0.152: U1.9 22.05,32.23 21.77,32.51 21.39,32.89 20.25,34.04 19.36,34.92 19.36,38.99 19.87,39.5 19.9,39.54 R5.1
N$23
  Top 0.152: R9.1 17.71,25.4 18.09,25.02 T1.3
TGT_CTS  (via drill 0.25)
  Top 0.152: U1.30 28.74,31.23 29.77,32.26 32.56,32.26 34.6,32.26 v36.38,30.48 | JP1.8 42.22,31.5 v41.2,30.48
  Bottom 0.152: v36.38,30.48 v41.2,30.48
TGT_NRESET  (via drill 0.25, 0.25 pad 0.25)
  Top 0.152: U1.8 22.65,33.03 v22.15,33.53 | v38.03,39.75 37.39,39.12 37.39,35.94 36.85,35.4 D3.A 36.25,34.16 37.9,32.51 v37.9,29.21 | CON3.10 55.42,44.07 48.57,44.07 v48.19,44.45 46.92,43.18 46.92,40.26 v46.41,39.75
  Bottom 0.152: v37.9,29.21 35.49,29.21 29.14,35.56 24.82,35.56 22.79,35.56 22.15,34.92 v22.15,33.53 | v38.03,39.75 42.09,39.75 v46.41,39.75 | JP1.7 43.49,51.56 43.49,49.66 48.19,44.96 v48.19,44.45
TGT_NRESET_BUTTON
  Top 0.152: R7.2 30.02,39.37 31.3,40.64 SW1.P$2 34.09,40.64 34.6,40.13 R8.2 36.18,37.93 D3.K
TGT_NRESET_FB
  Top 0.152: U1.3 25.95,34.66 26.34,35.05 29.64,35.05 30.02,35.43 R7.1
TGT_NRESET_FB_ISP
  Top 0.152: R8.1 34.6,35.56 34.47,35.43 32.06,35.43 31.68,35.05 30.91,34.29 29.9,34.29 28.64,33.03 U1.1
TGT_RTS  (via drill 0.25, 0.25 pad 0.25)
  Top 0.152: U1.16 22.65,27.55 v22.28,27.18 R4.2 | v44.76,28.7 JP1.6
  Bottom 0.152: v22.28,27.18 24.31,27.18 35.11,27.18 35.74,27.81 42.09,27.81 43.87,27.81 v44.76,28.7
TGT_RX  (via drill 0.25)
  Top 0.152: U1.32 28.47,32.23 29.9,33.66 33.84,33.66 v34.47,34.29 | CON3.8 55.42,42.55 53.65,42.55 49.71,42.55 v49.33,42.16 48.95,41.78 v48.95,36.96
  Bottom 0.152: v34.47,34.29 36.12,35.94 42.85,35.94 47.93,35.94 v48.95,36.96 | v49.33,42.16 39.93,42.16 38.41,43.69 38.41,51.56 JP1.11
TGT_SWCLK  (via drill 0.25, 0.25 pad 0.25)
  Top 0.152: R4.1 22.33,24.77 v23.42,24.77 23.93,25.27 23.93,27.91 U1.18 | CON3.4 55.42,40.26 v50.6,40.26 49.84,39.5 49.84,26.92 v49.2,26.29
  Bottom 0.152: v23.42,24.77 24.88,26.23 35.42,26.23 35.99,26.8 38.41,26.8 39.55,26.8 39.8,26.8 39.93,26.8 40.19,26.8 42.09,26.8 48.69,26.8 v49.2,26.29 | JP1.3 46.03,51.56 46.03,49.66 50.6,45.09 v50.6,40.26
TGT_SWDIO  (via drill 0.25, 0.25 pad 0.25)
  Top 0.152: v23.29,26.16 23.29,26.8 23.42,26.92 23.45,26.95 U1.17 | CON3.2 55.42,38.73 v51.49,38.73 50.73,37.97 v50.73,27.3
  Bottom 0.152: v23.29,26.16 23.8,26.67 35.23,26.67 35.87,27.3 39.68,27.3 40.19,27.3 42.09,27.3 v50.73,27.3 | v51.49,38.73 51.49,46.74 48.57,49.66 48.57,53.47 47.93,54.1 46.03,54.1 JP1.5
TGT_TX  (via drill 0.25)
  Top 0.152: U1.31 28.61,31.73 30.02,33.15 34.85,33.15 36.01,31.98 36.25,31.75 v36.88,31.75 | CON3.7 57.97,42.67 57.33,43.31 52.63,43.31 v48.95,43.31 48.19,42.55 47.81,42.16 47.81,32.26 v47.3,31.75
  Bottom 0.152: v36.88,31.75 42.09,31.75 v47.3,31.75 | v48.95,43.31 41.45,43.31 40.95,43.81 40.95,51.56 JP1.9
USB-D+
  Top 0.254: R11.1 16.56,28.45 16.44,28.32 16.38,28.26 IC1.4
USB-D-
  Top 0.254: R10.1 17.17,30.16 IC1.6
USB-SCON
  Top 0.152: T1.1 19.7,23.71 19.74,23.75 19.99,24 19.99,27.69 19.99,28.07 20.25,28.32 21.16,29.23 U1.15
USB_DM
  Top 0.152: C8.1 R10.2 19.61,30.23 20.88,30.23 U1.13
USB_DP
  Top 0.152: R9.2 C9.1 R11.2 19.74,28.45 21.02,29.73 U1.14
V_ISENSE  (via drill 0.25)
  Top 0.152: CON3.1 57.97,38.86 57.33,39.5 v52.38,39.5
  Bottom 0.152: v52.38,39.5 52.38,47.75 JP1.2
VIN+
  Top 0.406: R13.2 69.81,48.43 70.16,48.77 JP5.2
VIN-
  Top 0.406: R12.2 69.94,53.68 70.16,53.47 JP5.1

### Text on the board
tPlace: AD2 | TGT_RX | TGT_TX | NRST | SWDIO | SWCLK | GND | VIN- | GND | VIN+ | 3v3 | SDA | SCL | TARGET | 5v | VDET | RESET | TGT_CTS | TGT_RTS | DAPBench-LPC11U35 / v1.0.0 | LPC11U35 | 5v | PWR | DAP | COM | 3v3 5v | 3v3 5v | 3v3 5v | 3v3 | GND | GND | Vcc | NC | AD5 | NCS | MOSI | MISO | AD5 | GND | Vcc | AD3 | AD2 | GND | Vcc | SDA | SCL